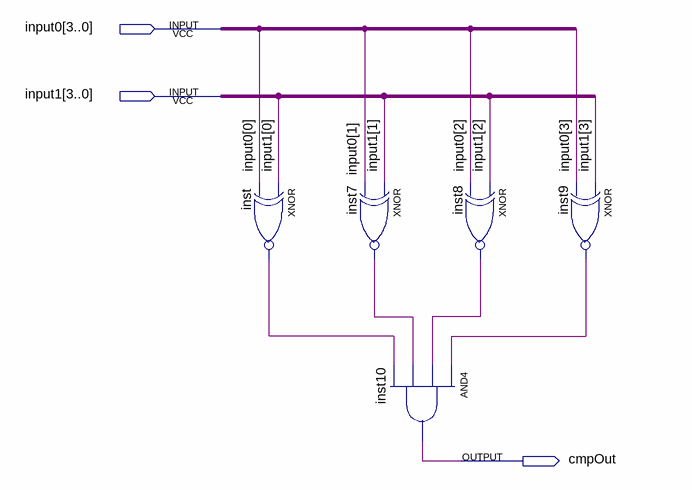
[diagram p0: schematic sheet]
// Quartus schematic EqCmp4.bdf as structural Verilog: 5 symbols, 3 pins
module EqCmp4 (
  input  [3:0] input0,
  input  [3:0] input1,
  output cmpOut
);

  wire inst7_out, inst8_out, inst9_out, inst_out;

  xnor inst (inst_out, input1[0], input0[0]);
  xnor inst7 (inst7_out, input1[1], input0[1]);
  and inst10 (cmpOut, inst9_out, inst8_out, inst7_out, inst_out);
  xnor inst8 (inst8_out, input1[2], input0[2]);
  xnor inst9 (inst9_out, input1[3], input0[3]);
endmodule
